# Altium schematic sheet MCU.SchDoc
size A4
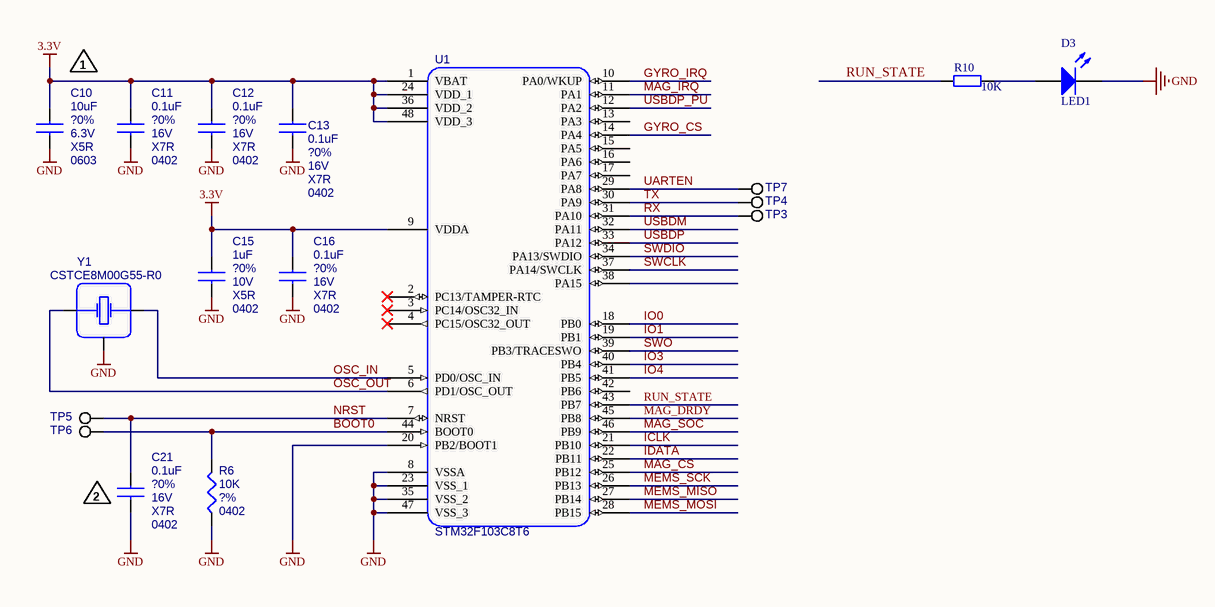
[diagram p0: MCU.SchDoc]

## Parts
C10  10uF  Tolerance: ?0%  Voltage: 6.3V  Dielectric: X5R  Package: 0603  [CAP_CERAMIC_0603]
C11  0.1uF  Tolerance: ?0%  Voltage: 16V  Dielectric: X7R  Package: 0402  [CAP_CERAMIC_0402]
C12  0.1uF  Tolerance: ?0%  Voltage: 16V  Dielectric: X7R  Package: 0402  [CAP_CERAMIC_0402]
C13  0.1uF  Tolerance: ?0%  Voltage: 16V  Dielectric: X7R  Package: 0402  [CAP_0402]
C15  1uF  Tolerance: ?0%  Voltage: 10V  Dielectric: X5R  Package: 0402  [CAP_CERAMIC_0402]
C16  0.1uF  Tolerance: ?0%  Voltage: 16V  Dielectric: X7R  Package: 0402  [CAP_CERAMIC_0402]
C21  0.1uF  Tolerance: ?0%  Voltage: 16V  Dielectric: X7R  Package: 0402  [CAP_CERAMIC_0402]
D3  LED1  [CAP_CERAMIC_0402]
R6  10K  Package: 0402  Tolerance: ?%  [RESISTOR_0402]
R10  value 10K  [RESISTOR_0402]
TP3  TEST POINT  [TEST_POINT_PAD]  (value not drawn)  (no BOM)
TP4  TEST POINT  [TEST_POINT_PAD]  (value not drawn)  (no BOM)
TP5  TEST POINT  [TEST_POINT_PAD]  (value not drawn)  (no BOM)
TP6  TEST POINT  [TEST_POINT_PAD]  (value not drawn)  (no BOM)
TP7  TEST POINT  [TEST_POINT_PAD]  (value not drawn)  (no BOM)
U1  STM32F103C8T6  [LQFP48]
Y1  CSTCE8M00G55-R0  [CSTCE]

## Nets
3.3V: C10.1 C11.1 C12.1 C13.2 C15.1 C16.1 U1.1(VBAT) U1.9(VDDA) U1.24(VDD_1) U1.36(VDD_2) U1.48(VDD_3)
GND: C10.2 C11.2 C12.2 C13.1 C15.2 C16.2 C21.2 D3.2(K) R6.1 U1.8(VSSA) U1.20(PB2/BOOT1) U1.23(VSS_1) U1.35(VSS_2) U1.47(VSS_3) Y1.2(GND)
BOOT0: R6.2 TP6.1 U1.44(BOOT0)
GYRO_CS: U1.14(PA4)
GYRO_IRQ: U1.10(PA0/WKUP)
ICLK: U1.21(PB10)
IDATA: U1.22(PB11)
IO0: U1.18(PB0)
IO1: U1.19(PB1)
IO3: U1.40(PB4)
IO4: U1.41(PB5)
MAG_CS: U1.25(PB12)
MAG_DRDY: U1.45(PB8)
MAG_IRQ: U1.11(PA1)
MAG_SOC: U1.46(PB9)
MEMS_MISO: U1.27(PB14)
MEMS_MOSI: U1.28(PB15)
MEMS_SCK: U1.26(PB13)
NRST: C21.1 TP5.1 U1.7(NRST)
OSC_IN: U1.5(PD0/OSC_IN) Y1.3
OSC_OUT: U1.6(PD1/OSC_OUT) Y1.1
RUN_STATE: R10.2 U1.43(PB7)
RX: TP3.1 U1.31(PA10)
SWCLK: U1.37(PA14/SWCLK)
SWDIO: U1.34(PA13/SWDIO)
SWO: U1.39(PB3/TRACESWO)
TX: TP4.1 U1.30(PA9)
UARTEN: TP7.1 U1.29(PA8)
USBDM: U1.32(PA11)
USBDP: U1.33(PA12)
USBDP_PU: U1.12(PA2)
NetD3_1: D3.1(A) R10.1

Not connected (* = marked no-connect by the designer): U1 2(PC13/TAMPER-RTC)* 3(PC14/OSC32_IN)* 4(PC15/OSC32_OUT)* 13(PA3) 15(PA5) 16(PA6) 17(PA7) 38(PA15) 42(PB6)

## Notes on the sheet
- 1
- (near C21) 2

## Library data of the parts
C10 = CAP, CERAMIC: CAP, CERAMIC, 10uF, ?0%, 6.3V, X5R, 0603; Manufacturer: MURATA ELECTRONICS; Part Number: GRM188R60J106ME47D
C11-C13 C16 C21 = CAP, CERAMIC: CAP, CERAMIC, 0.1uF, ?0%, 16V, X7R, 0402; Manufacturer: MURATA ELECTRONICS; Part Number: GRM155R71C104KA88D
C15 = CAP, CERAMIC: CAP, CERAMIC, 1uF, ?0%, 10V, X5R, 0402; Manufacturer: MURATA ELECTRONICS; Part Number: GRM155R61A105KE15D
D3 = LED1: Typical RED GaAs LED; Published: 8-Jun-2000; LatestRevisionDate: 08-Jul-2005; LatestRevisionNote: Mech Layer 1 removed.; PackageReference: LED-1; Publisher: Altium Limited
R6 = RESISTOR: RES, 10K OHM, 1/10W, ?%, 0402; Manufacturer: PANASONIC; Part Number: ERJ-2RKF1002X; Power Rating: 1/10W
R10 = Res2: Resistor; Published: 8-Jun-2000; LatestRevisionDate: 17-Jul-2002; LatestRevisionNote: Re-released for DXP Platform.; PackageReference: AXIAL-0.4; Publisher: Altium Limited
TP3-TP7 = TEST_POINT: Manufacturer: *; Part Number: *
U1 = STM32F103C8T6: IC, STM32 MICROCONTROLLER, ARM CORTEX M3; Manufacturer: ST MICROELECTRONICS; Part Number: STM32F103C8T6; Verified Pinout: *
Y1 = CSTCE8M00G55-R0: CERAMIC RESONATOR, 8MHz, +/-0.2%, 33pF, SMD; Manufacturer: MURATA ELECTRONICS; Part Number: CSTCE8M00G55-R0; Pinout Verified: *